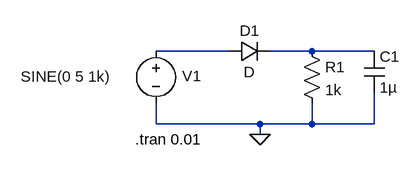
[diagram p0: schematic RC Parallel Circuit with a Diodie.asc]
RC Parallel Circuit with a Diodie.asc, the LTspice schematic file:
Version 4
SHEET 1 880 680
WIRE 112 160 0 160
WIRE 240 160 176 160
WIRE 336 160 240 160
WIRE 0 272 0 240
WIRE 160 272 0 272
WIRE 240 272 240 240
WIRE 240 272 160 272
WIRE 336 272 336 224
WIRE 336 272 240 272
WIRE 160 288 160 272
FLAG 160 288 0
SYMBOL cap 320 160 R0
SYMATTR InstName C1
SYMATTR Value 1µ
SYMBOL res 224 144 R0
SYMATTR InstName R1
SYMATTR Value 1k
SYMBOL diode 112 176 R270
WINDOW 0 32 32 VTop 2
WINDOW 3 0 32 VBottom 2
SYMATTR InstName D1
SYMBOL voltage 0 144 R0
WINDOW 0 40 54 Left 2
WINDOW 3 -208 55 Left 2
WINDOW 123 0 0 Left 0
WINDOW 39 0 0 Left 0
SYMATTR InstName V1
SYMATTR Value SINE(0 5 1k)
TEXT -32 296 Left 2 !.tran 0.01

The netlist it stands for:
* RC Parallel Circuit with a Diodie.asc
C1 N002 0 1µ
R1 N002 0 1k
D1 N001 N002 D
V1 N001 0 SINE(0 5 1k)
.model D D
.lib standard.dio
.tran 0.01
.backanno
.end